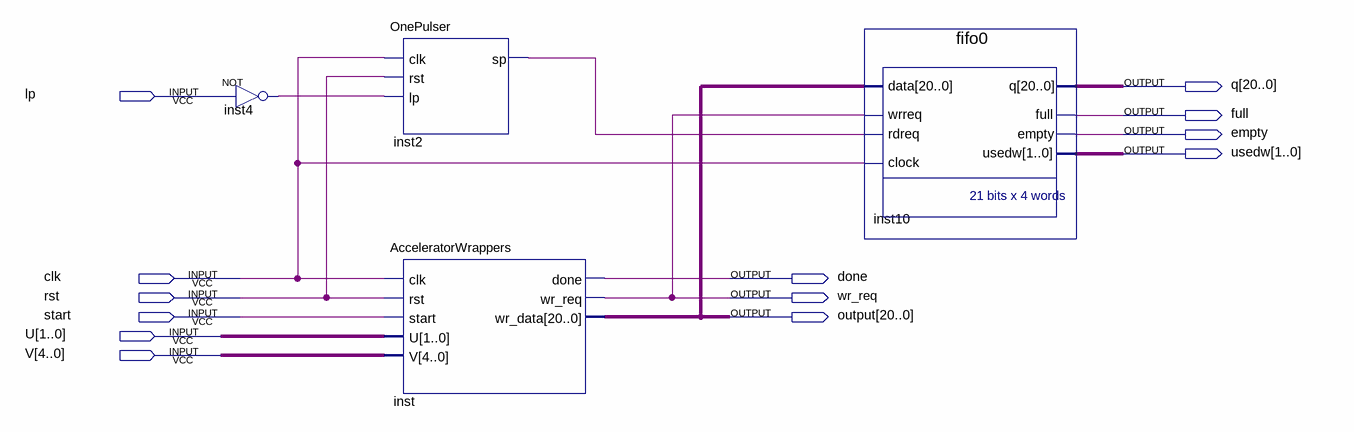
[diagram p0: schematic sheet]
// Quartus schematic AW.bdf as structural Verilog: 4 symbols, 13 pins
module AW (
  input  lp,
  input  clk,
  input  rst,
  input  start,
  input  [1:0] U,
  input  [4:0] V,
  output [20:0] q,
  output full,
  output empty,
  output [1:0] usedw,
  output done,
  output wr_req,
  output [20:0] \output 
);

  wire inst2_sp, inst4_out;

  not inst4 (inst4_out, lp);
  OnePulser inst2 (.clk(clk), .rst(rst), .lp(inst4_out), .sp(inst2_sp));
  AcceleratorWrappers inst (
    .clk(clk), .rst(rst), .start(start), .U(U), .V(V), .done(done), .wr_req(wr_req), .wr_data(\output ));
  fifo0 inst10 (
    .data(\output ), .wrreq(wr_req), .rdreq(inst2_sp), .clock(clk), .q(q), .full(full), .empty(empty),
    .usedw(usedw));
endmodule
